# Altium project Extruder Fin.PrjPCB
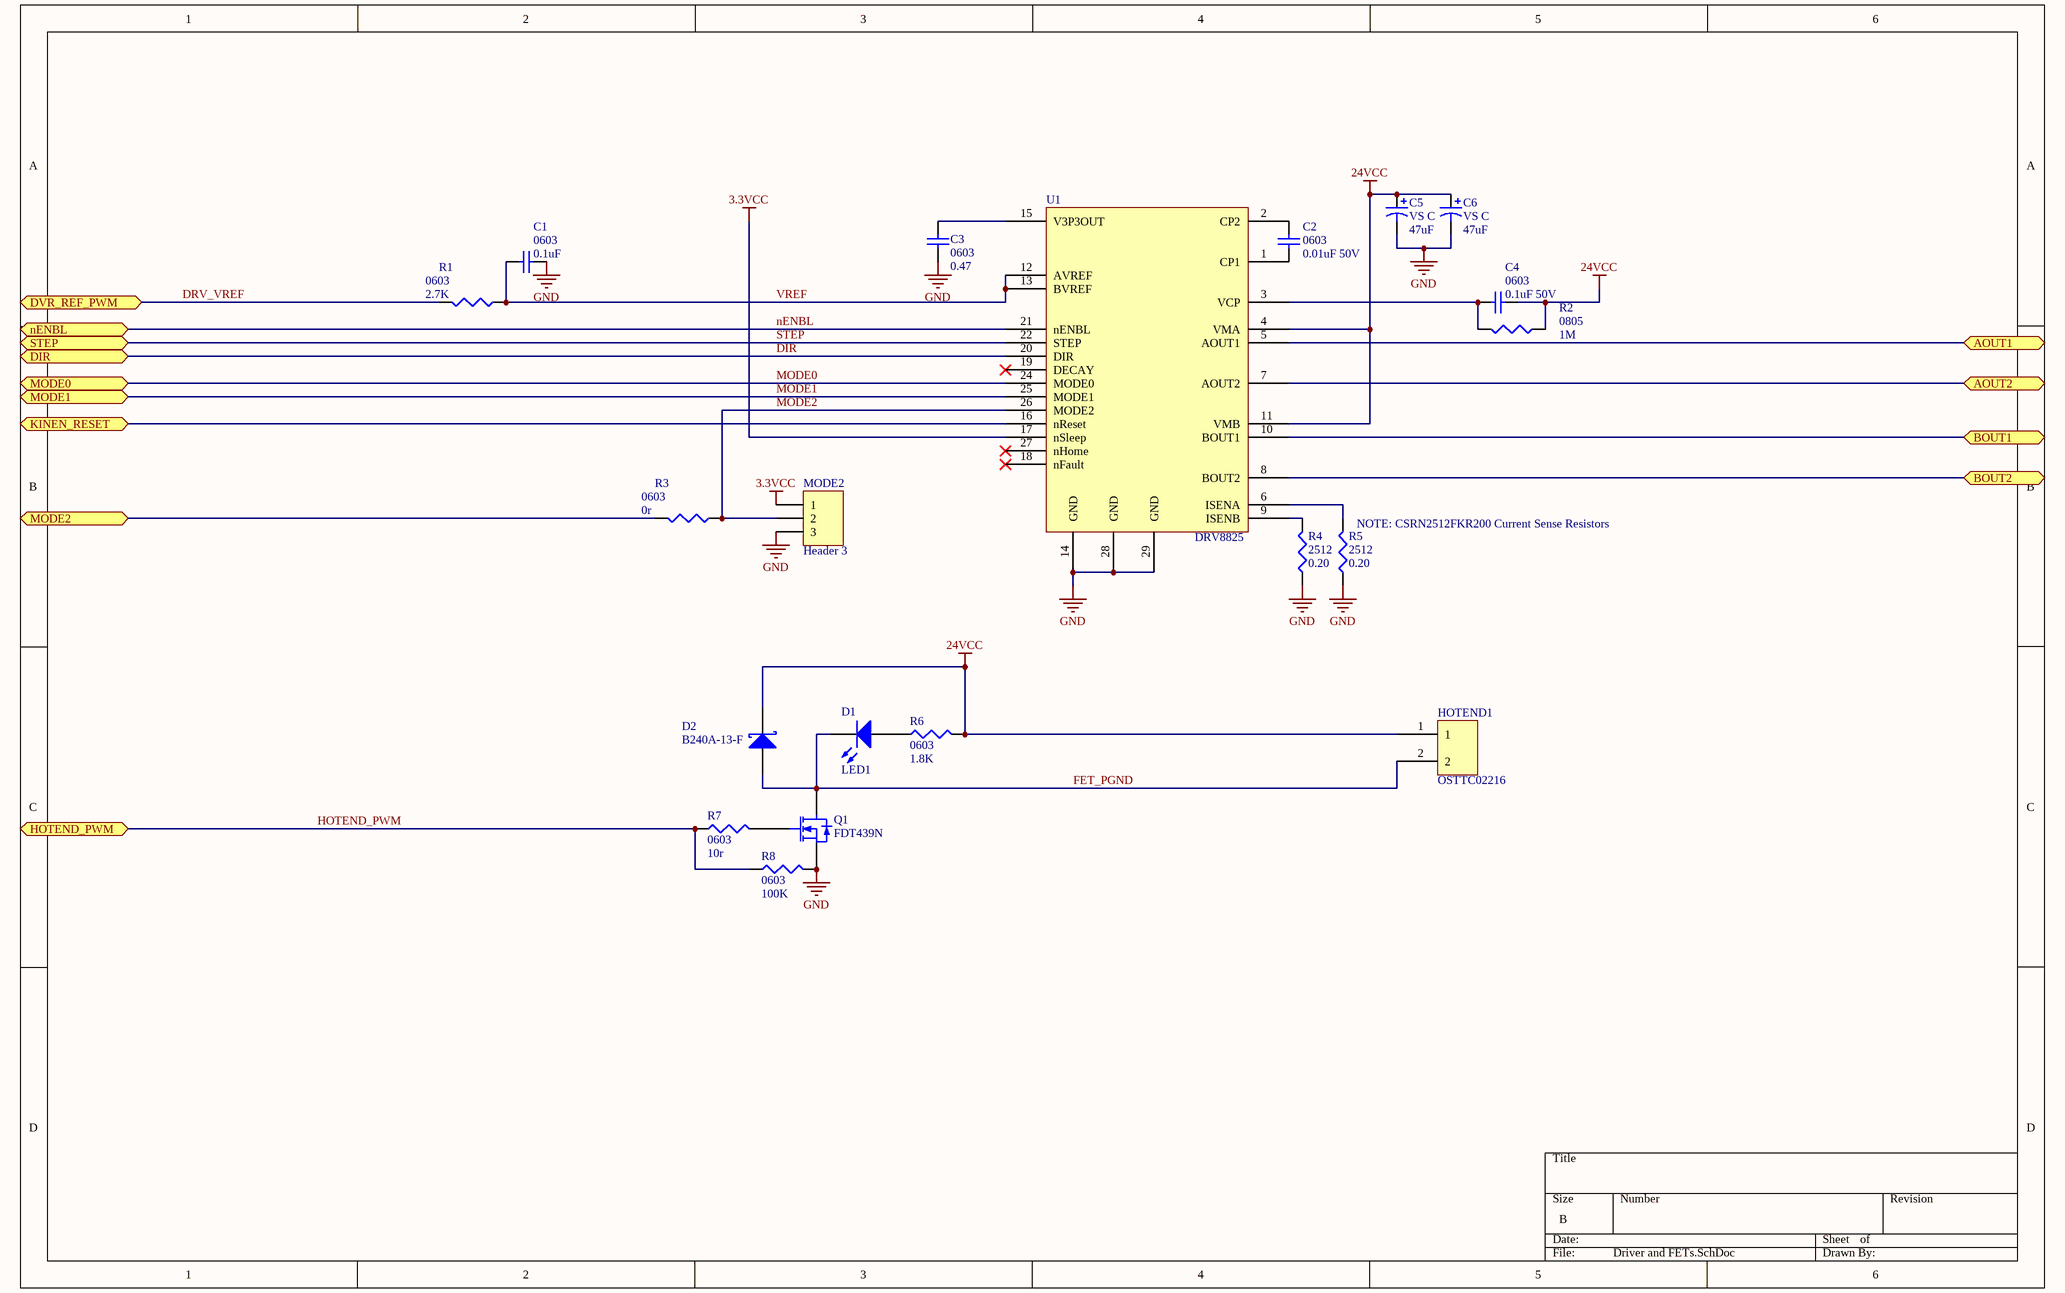
[diagram p0: Driver and FETs.SchDoc]
4 sheets, 68 parts. Net scope: flat (ports and power ports of the same name join across sheets).
Board file: Extruder Fin.PcbDoc
Sheets:
  Driver and FETs.SchDoc
  Kinen Port.SchDoc
  Fan FETs and Thermo.SchDoc
  CM0 Controller FreeScale.SchDoc

## Sheet Driver and FETs.SchDoc
size B

### Parts
C1  0603  value 0.1uF  [1608[0603]]
C2  0603  value 0.01uF 50V  [1608[0603]]
C3  0603  value 0.47  [1608[0603]]
C4  0603  value 0.1uF 50V  [1608[0603]]
C5  VS C  value 47uF  [Panasonic VS C]
C6  VS C  value 47uF  [Panasonic VS C]
D1  LED1  [SM 0805 polarized]
D2  B240A-13-F  [B240A-13-F]
HOTEND1  OSTTC02216  [OSTTC02216]
MODE2  Header 3  [HDR1X3]
Q1  FDT439N  [Fairchild FDT439N]
R1  0603  value 2.7K  [J1-0603]
R2  0805  value 1M  [SM 0805 - gap trimmed]
R3  0603  value 0r  [J1-0603]
R4  2512  value 0.20  [Resistor2512]
R5  2512  value 0.20  [Resistor2512]
R6  0603  value 1.8K  [J1-0603]
R7  0603  value 10r  [J1-0603]
R8  0603  value 100K  [J1-0603]
U1  DRV8825  [DRV8825]

### Ports
AOUT1, AOUT2, BOUT1, BOUT2, DIR, DVR_REF_PWM, HOTEND_PWM, KINEN_RESET, MODE0, MODE1, MODE2, nENBL, STEP

### Nets
2: Q1.4(D)
3.3VCC: MODE2.1 U1.17(nSleep)
24VCC: C4.1 C5.1 C6.1 D2.2(K) HOTEND1.1 R2.1 R6.2 U1.4(VMA) U1.11(VMB)
GND: C1.1 C3.1 C5.2 C6.2 MODE2.3 Q1.3(S) R4.1 R5.1 R8.2 U1.14(GND) U1.28(GND) U1.29(GND)
AOUT1: U1.5(AOUT1) ; port AOUT1
AOUT2: U1.7(AOUT2) ; port AOUT2
BOUT1: U1.10(BOUT1) ; port BOUT1
BOUT2: U1.8(BOUT2) ; port BOUT2
DIR: U1.20(DIR) ; port DIR
DRV_VREF: R1.2 ; port DVR_REF_PWM
FET_PGND: D1.2(K) D2.1(A) HOTEND1.2 Q1.2(D)
HOTEND_PWM: R7.1 R8.1 ; port HOTEND_PWM
KINEN_RESET: U1.16(nReset) ; port KINEN_RESET
MODE0: U1.24(MODE0) ; port MODE0
MODE1: U1.25(MODE1) ; port MODE1
MODE2: MODE2.2 R3.1 U1.26(MODE2)
nENBL: U1.21(nENBL) ; port nENBL
STEP: U1.22(STEP) ; port STEP
VREF: C1.2 R1.1 U1.12(AVREF) U1.13(BVREF)
NetC2_1: C2.1 U1.1(CP1)
NetC2_2: C2.2 U1.2(CP2)
NetC3_2: C3.2 U1.15(V3P3OUT)
NetC4_2: C4.2 R2.2 U1.3(VCP)
NetD1_1: D1.1(A) R6.1
NetKINEN_21: R3.2 ; port MODE2
NetQ1_1: Q1.1(G) R7.2
NetR4_2: R4.2 U1.9(ISENB)
NetR5_2: R5.2 U1.6(ISENA)

Not connected (* = marked no-connect by the designer): U1 18(nFault)* 19(DECAY)* 23(NC) 27(nHome)*

### Notes on the sheet
- (near R5) NOTE: CSRN2512FKR200 Current Sense Resistors

### Library data of the parts
C1-C4 = Cap Semi: Capacitor (Semiconductor SIM Model); Published: 8-Jun-2000; LatestRevisionDate: 29-May-2009; LatestRevisionNote: IPC-7351 Footprint Added.; PackageReference: C1206; Publisher: Altium Limited; PackageDescription: Chip Capacitor
C5 C6 = Cap Pol1: Polarized Capacitor (Radial); Published: 8-Jun-2000; LatestRevisionDate: 17-Jul-2002; LatestRevisionNote: Re-released for DXP Platform.; PackageReference: RB7.6-15; Publisher: Altium Limited; PackageDescription: Polarized Capacitor (Radial); 2 Leads
D1 = LED1: Typical RED GaAs LED; Published: 8-Jun-2000; LatestRevisionDate: 08-Jul-2005; LatestRevisionNote: Mech Layer 1 removed.; PackageReference: LED-1; Publisher: Altium Limited; PackageDescription: LED; 2 Leads
D2 = D Schottky: Schottky Diode; Published: 8-Jun-2000; LatestRevisionDate: 17-Jul-2002; LatestRevisionNote: Re-released for DXP Platform.; PackageReference: SMB; Publisher: Altium Limited; PackageDescription: DO-214-AA/SMB; 2 C-Bend Leads; Body 5.3 x 3.6 mm, inc. leads (LxW); Code_JEDEC: DO-214-AA
HOTEND1 = Pheonix Contact 2X1
MODE2 = Header 3: Header, 3-Pin; LatestRevisionDate: 17-Jul-2002; LatestRevisionNote: Re-released for DXP Platform.; Publisher: Altium Limited
Q1 = Fairchild FDT439N: N-Channel MOSFET; Published: 8-Jun-2000; LatestRevisionDate: 17-Jul-2002; LatestRevisionNote: Re-released for DXP Platform.; PackageVersion: 1995/1996; PackageReference: E3; Publisher: Altium Limited; PackageDescription: TO, Flat Index; 3 In-Line, Axial Leads; Body Dia. 4.6mm; Lead Dia. 0.5 mm (max)
R1-R8 = Res3: Resistor; Published: 8-Jun-2000; LatestRevisionDate: 29-May-2009; LatestRevisionNote: IPC-7351 Footprint Added.; PackageReference: J1-0603; Publisher: Altium Limited; PackageDescription: Chip Resistor
U1 = DRV8825: DRV8825 Ti Stepper Driver

## Sheet Kinen Port.SchDoc
size A
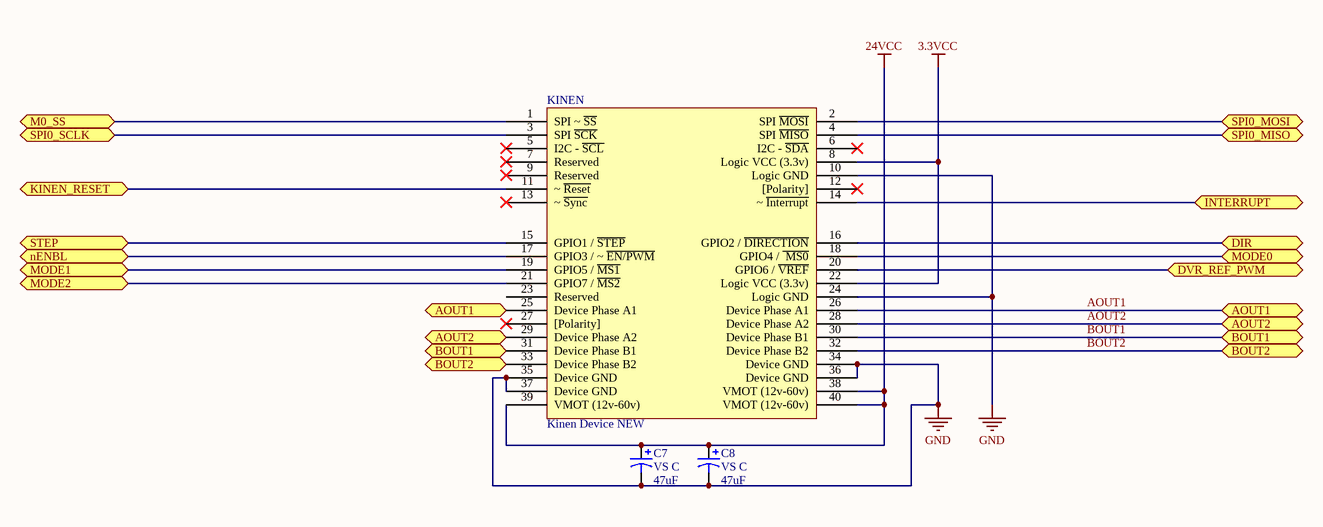
[diagram p1: Kinen Port.SchDoc]

### Parts
C7  VS C  value 47uF  [Panasonic VS C]
C8  VS C  value 47uF  [Panasonic VS C]
KINEN  Kinen Device NEW  [Kinen Port - Device]

### Ports
AOUT1, AOUT2, BOUT1, BOUT2, DIR, DVR_REF_PWM, INTERRUPT, KINEN_RESET, M0_SS, MODE0, MODE1, MODE2, nENBL, SPI0_MISO, SPI0_MOSI, SPI0_SCLK, STEP

### Nets
3.3VCC: KINEN.8(Logic_VCC_(3.3v)) KINEN.22(Logic_VCC_(3.3v))
24VCC: C7.1 C8.1 KINEN.38(VMOT_(12v-60v)) KINEN.39(VMOT_(12v-60v)) KINEN.40(VMOT_(12v-60v))
GND: C7.2 C8.2 KINEN.10(Logic_GND) KINEN.24(Logic_GND) KINEN.34(Device_GND) KINEN.35(Device_GND) KINEN.36(Device_GND) KINEN.37(Device_GND)
AOUT1: KINEN.25(Device_Phase_A1) KINEN.26(Device_Phase_A1) ; port AOUT1
AOUT2: KINEN.28(Device_Phase_A2) KINEN.29(Device_Phase_A2) ; port AOUT2
BOUT1: KINEN.30(Device_Phase_B1) KINEN.31(Device_Phase_B1) ; port BOUT1
BOUT2: KINEN.32(Device_Phase_B2) KINEN.33(Device_Phase_B2) ; port BOUT2
DIR: KINEN.16(GPIO2_/_~{DIRECTION}) ; port DIR
DRV_VREF: KINEN.20(GPIO6_/_~{VREF}) ; port DVR_REF_PWM
KINEN_RESET: KINEN.11(~_~{Reset}) ; port KINEN_RESET
M0_SS: KINEN.1(SPI_~_~{SS}) ; port M0_SS
MODE0: KINEN.18(GPIO4_/_~{_MS0}) ; port MODE0
MODE1: KINEN.19(GPIO5_/_~{MS1}) ; port MODE1
nENBL: KINEN.17(GPIO3_/_~_~{EN/PWM}) ; port nENBL
SPI0_MISO: KINEN.4(SPI_~{MISO}) ; port SPI0_MISO
SPI0_MOSI: KINEN.2(SPI_~{MOSI}) ; port SPI0_MOSI
SPI0_SCLK: KINEN.3(SPI_~{SCK}) ; port SPI0_SCLK
STEP: KINEN.15(GPIO1_/_~{STEP}) ; port STEP
NetKINEN_14: KINEN.14(~_~{Interrupt}) ; port INTERRUPT
NetKINEN_21: KINEN.21(GPIO7_/_~{MS2}) ; port MODE2

Not connected (* = marked no-connect by the designer): KINEN 5(I2C_-_~{SCL})* 6(I2C_-_~{SDA})* 7(Reserved)* 9(Reserved)* 12([Polarity])* 13(~_~{Sync})* 23(Reserved) 27([Polarity])*

### Library data of the parts
C7 C8 = Cap Pol1: Polarized Capacitor (Radial); Published: 8-Jun-2000; LatestRevisionDate: 17-Jul-2002; LatestRevisionNote: Re-released for DXP Platform.; PackageReference: RB7.6-15; Publisher: Altium Limited; PackageDescription: Polarized Capacitor (Radial); 2 Leads

## Sheet Fan FETs and Thermo.SchDoc
size A
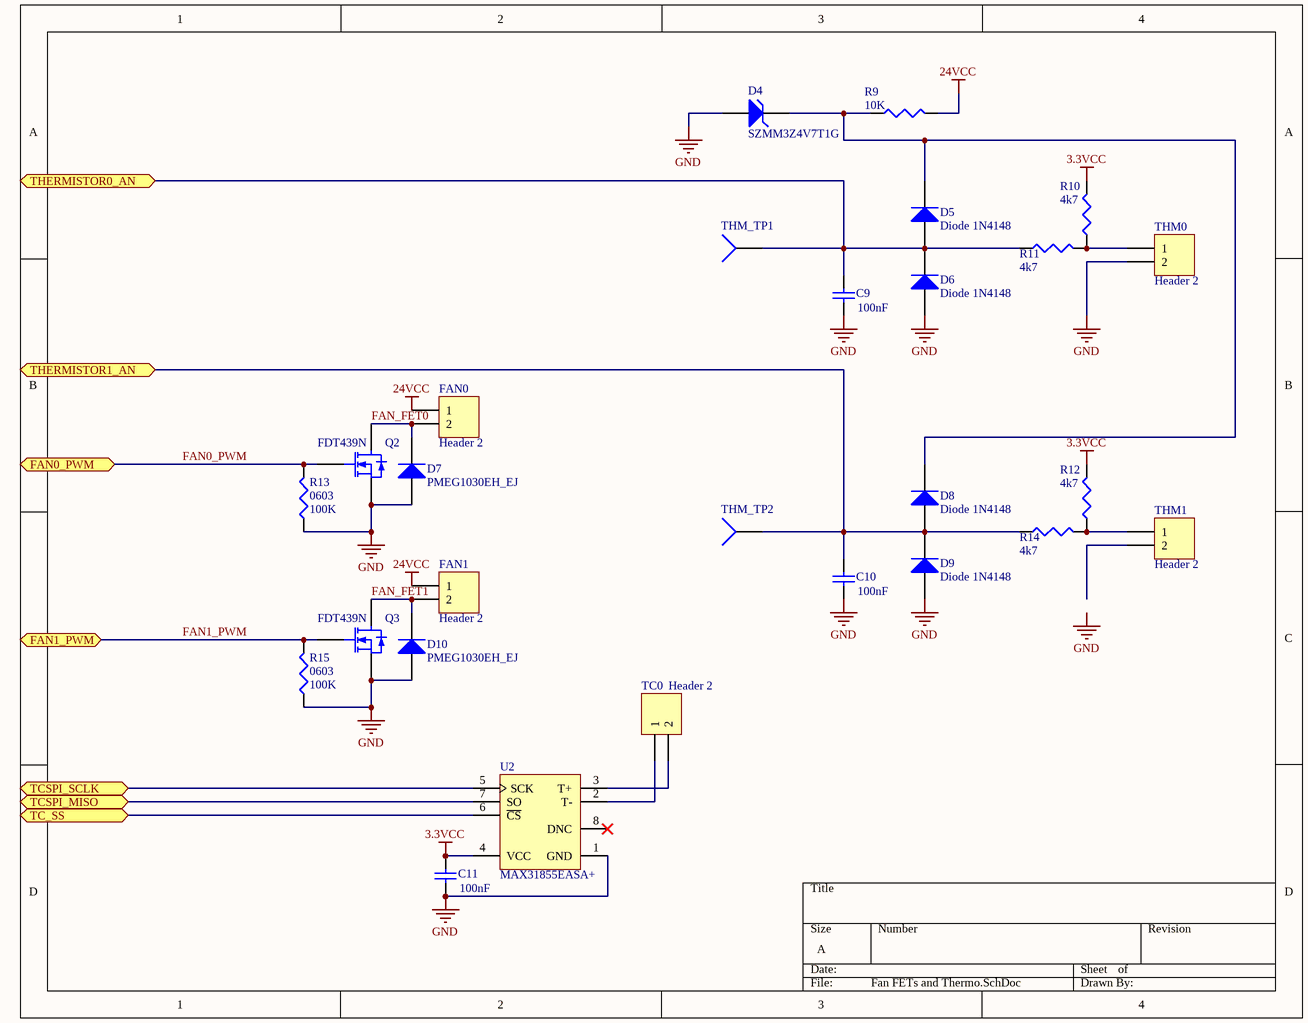
[diagram p2: Fan FETs and Thermo.SchDoc]

### Parts
C9  value 100nF  [1608[0603]]  (hidden comment: Cap Semi)
C10  value 100nF  [1608[0603]]  (hidden comment: Cap Semi)
C11  value 100nF  [1608[0603]]  (hidden comment: Cap Semi)
D4  SZMM3Z4V7T1G  [SZMM3Z4V7T1G]
D5  Diode 1N4148  [1N4148WT]
D6  Diode 1N4148  [1N4148WT]
D7  PMEG1030EH_EJ  [SOD-323]
D8  Diode 1N4148  [1N4148WT]
D9  Diode 1N4148  [1N4148WT]
D10  PMEG1030EH_EJ  [SOD-323]
FAN0  Header 2  [HDR1X2]
FAN1  Header 2  [HDR1X2]
Q2  FDT439N  [Fairchild FDT439N]
Q3  FDT439N  [Fairchild FDT439N]
R9  value 10K  [J1-0603]  (hidden comment: Res3)
R10  value 4k7  [J1-0603]  (hidden comment: Res3)
R11  value 4k7  [J1-0603]  (hidden comment: Res3)
R12  value 4k7  [J1-0603]  (hidden comment: Res3)
R13  0603  value 100K  [J1-0603]
R14  value 4k7  [J1-0603]  (hidden comment: Res3)
R15  0603  value 100K  [J1-0603]
TC0  Header 2  [HDR1X2]
THM0  Header 2  [HDR1X2]
THM1  Header 2  [HDR1X2]
THM_TP1  TP4  [PIN1]  (value not drawn)
THM_TP2  TP4  [PIN1]  (value not drawn)
U2  MAX31855EASA+  [MAXM-S8+4_N]

### Ports
FAN0_PWM, FAN1_PWM, TC_SS, TCSPI_MISO, TCSPI_SCLK, THERMISTOR0_AN, THERMISTOR1_AN

### Nets
2: Q2.4(D) Q3.4(D)
3.3VCC: C11.2 R10.2 R12.2 U2.4(VCC)
24VCC: FAN0.1 FAN1.1 R9.2
GND: C9.1 C10.1 C11.1 D4.1(A) D6.1(A) D7.1(A) D9.1(A) D10.1(A) Q2.3(S) Q3.3(S) R13.1 R15.1 THM0.2 U2.1(GND)
FAN0_PWM: Q2.1(G) R13.2 ; port FAN0_PWM
FAN1_PWM: Q3.1(G) R15.2 ; port FAN1_PWM
FAN_FET0: D7.2(K) FAN0.2 Q2.2(D)
FAN_FET1: D10.2(K) FAN1.2 Q3.2(D)
NetC9_2: C9.2 D5.1(A) D6.2(K) R11.1 THM_TP1.1 ; port THERMISTOR0_AN
NetC10_2: C10.2 D8.1(A) D9.2(K) R14.1 THM_TP2.1 ; port THERMISTOR1_AN
NetD4_2: D4.2(K) D5.2(K) D8.2(K) R9.1
NetR10_1: R10.1 R11.2 THM0.1
NetR12_1: R12.1 R14.2 THM1.1
NetTC0_1: TC0.1 U2.2(T-)
NetTC0_2: TC0.2 U2.3(T+)
NetU2_5: U2.5(SCK) ; port TCSPI_SCLK
NetU2_6: U2.6(~{CS}) ; port TC_SS
NetU2_7: U2.7(SO) ; port TCSPI_MISO

Not connected (* = marked no-connect by the designer): THM1 2; U2 8(DNC)*

### Notes on the sheet
- Labels drawn without touching a wire or pin: GND

### Library data of the parts
C9-C11 = Cap Semi: Capacitor (Semiconductor SIM Model); Published: 8-Jun-2000; LatestRevisionDate: 29-May-2009; LatestRevisionNote: IPC-7351 Footprint Added.; PackageReference: C1206; Publisher: Altium Limited; PackageDescription: Chip Capacitor
D4 = D Zener: Zener Diode; Published: 8-Jun-2000; LatestRevisionDate: 17-Jul-2002; LatestRevisionNote: Re-released for DXP Platform.; PackageReference: DIODE-0.7; Publisher: Altium Limited; PackageDescription: Diode, Thru-Hole; 2 Leads; 0.7 in Pin Spacing
D5 D6 D8 D9 = Diode 1N4148: High Conductance Fast Diode; Published: 8-Jun-2000; LatestRevisionDate: 17-Jul-2002; LatestRevisionNote: Re-released for DXP Platform.; DatasheetVersion: 1997; PackageReference: DO-35; Publisher: Altium Limited; PackageDescription: Diode, Axial; Body 3.8 x 1.9 mm (LxDia. max), Lead Dia. 0.53 mm (max); Code_JEDEC: DO-204-AH; ComponentLink1Description: Manufacturer Link; ComponentLink1URL: http://www.fairchildsemi.com/; ComponentLink2Description: Datasheet; ComponentLink2URL: http://www.fairchildsemi.com/ds/1N%2F1N4148.pdf
D7 D10 = Diode: Default Diode; Published: 8-Jun-2000; LatestRevisionDate: 17-Jul-2002; LatestRevisionNote: Re-released for DXP Platform.; PackageVersion: Sep-1996; PackageReference: SMC; Publisher: Altium Limited; PackageDescription: DO-214-AB/SMC; 2 C-Bend Leads; Body 7.9 x 5.9 mm, inc. leads (LxW); Code_JEDEC: DO-214-AB
FAN0 FAN1 TC0 THM0 THM1 = Header 2: Header, 2-Pin; LatestRevisionDate: 17-Jul-2002; LatestRevisionNote: Re-released for DXP Platform.; Publisher: Altium Limited
Q2 Q3 = Fairchild FDT439N: N-Channel MOSFET; Published: 8-Jun-2000; LatestRevisionDate: 17-Jul-2002; LatestRevisionNote: Re-released for DXP Platform.; PackageVersion: 1995/1996; PackageReference: E3; Publisher: Altium Limited; PackageDescription: TO, Flat Index; 3 In-Line, Axial Leads; Body Dia. 4.6mm; Lead Dia. 0.5 mm (max)
R9-R15 = Res3: Resistor; Published: 8-Jun-2000; LatestRevisionDate: 29-May-2009; LatestRevisionNote: IPC-7351 Footprint Added.; PackageReference: J1-0603; Publisher: Altium Limited; PackageDescription: Chip Resistor
THM_TP1 THM_TP2 = Socket: LatestRevisionDate: 17-Jul-2002; LatestRevisionNote: Re-released for DXP Platform.; Publisher: Altium Limited
U2 = MAX31855EASA+: Cold Junction Compensated Thermocouple to Digital Converter, 14 Bits Temperature Resolution, -40 to 125 degC, 8-Pin SOIC (S8+4), Pb-Free; Functions: Thermocouple-to-Digital Converter; Interface: SPI; Parasite Pwr.: No; DatasheetVersion: Rev. 2; PackageVersion: Rev. D, 10/2012; PackageReference: S8+4; PackageDescription: 8-Pin Small-Outline IC, Narrow, Body 3.9 x 4.9 mm, Pitch 1.27 mm; Supplier 1: Digi-Key; Supplier Part Number 1: MAX31855EASA+-ND; Supplier 2: Mouser; Supplier Part Number 2: 700-MAX31855EASA+; Generic Part Number: MAX31855; Mounting Technology: Surface Mount; Code_JEDEC: MS-012; PartNumber: MAX31855EASA+; ComponentLink1Description: Manufacturer URL; ComponentLink1URL: http://www.maximintegrated.com/; ComponentLink2Description: Datasheet; ComponentLink2URL: http://datasheets.maximintegrated.com/en/ds/MAX31855.pdf; ComponentLink3Description: Package Specification; ComponentLink3URL: http://pdfserv.maximintegrated.com/package_dwgs/21-0041.PDF

## Sheet CM0 Controller FreeScale.SchDoc
size A
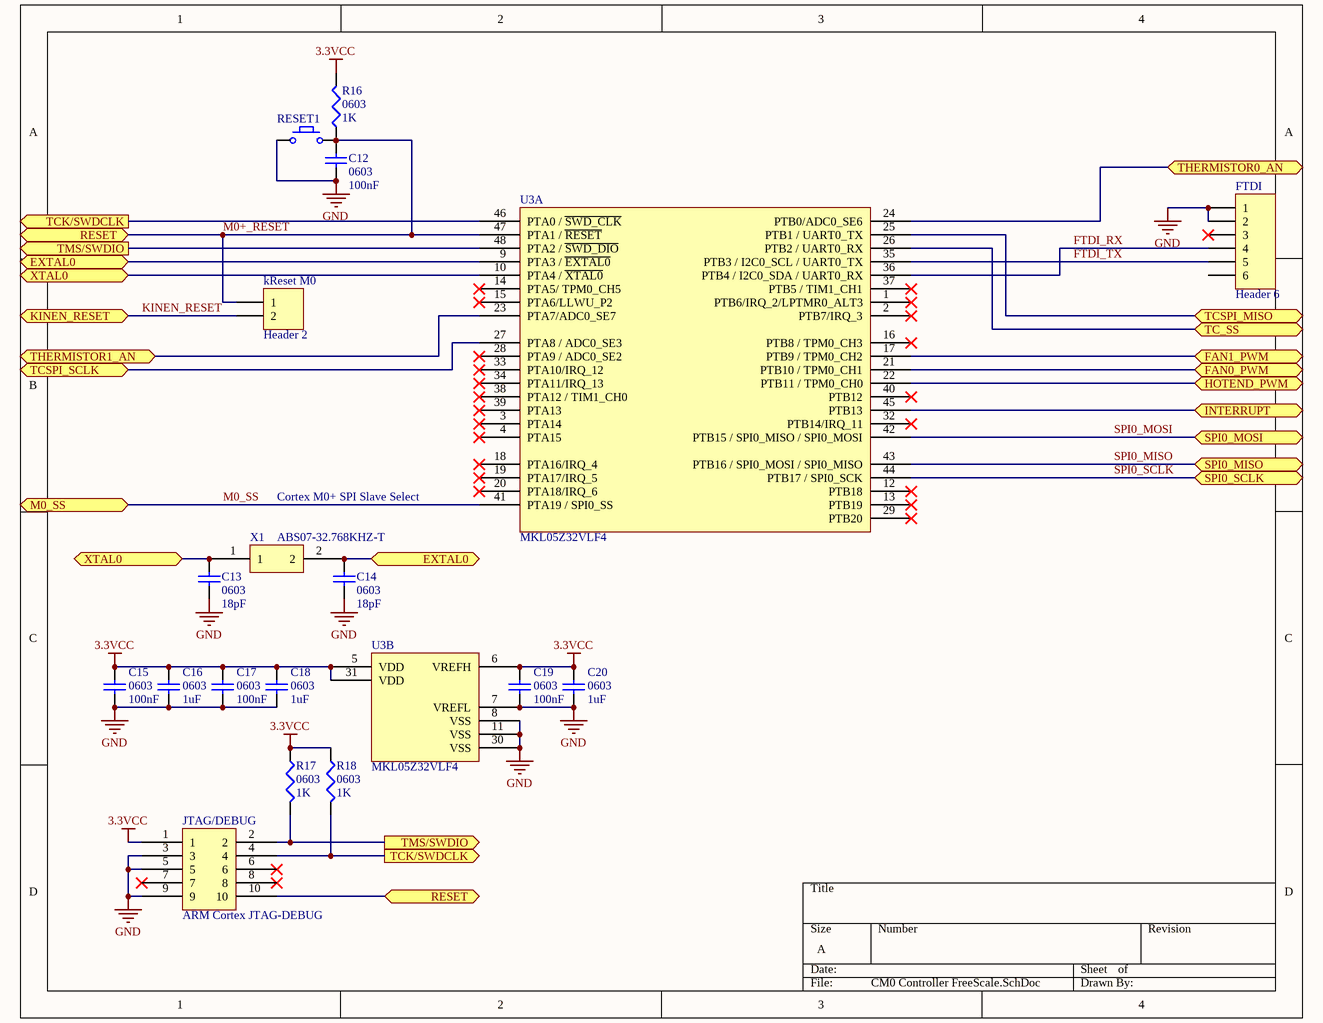
[diagram p3: CM0 Controller FreeScale.SchDoc]

### Parts
C12  0603  value 100nF  [1608[0603]]
C13  0603  value 18pF  [1608[0603]]
C14  0603  value 18pF  [1608[0603]]
C15  0603  value 100nF  [1608[0603]]
C16  0603  value 1uF  [1608[0603]]
C17  0603  value 100nF  [1608[0603]]
C18  0603  value 1uF  [1608[0603]]
C19  0603  value 100nF  [1608[0603]]
C20  0603  value 1uF  [1608[0603]]
FTDI  Header 6  [HDR1X6]
JTAG/DEBUG  ARM Cortex JTAG-DEBUG  [FTSH-105-XX-X-DV]
kReset_M0  Header 2  [HDR1X2]
R16  0603  value 1K  [J1-0603]
R17  0603  value 1K  [J1-0603]
R18  0603  value 1K  [J1-0603]
RESET1  Tactile Switch  [Mountain Switch TS6324T1607]  (value not drawn)
U3  MKL05Z32VLF4  [MKL05Z32VLF4]  (parts A,B of 2)
X1  ABS07-32.768KHZ-T  [ABS07-32.768KHZ-T]

### Ports
EXTAL0, FAN0_PWM, FAN1_PWM, HOTEND_PWM, INTERRUPT, KINEN_RESET, M0_SS, RESET (bidir), SPI0_MISO, SPI0_MOSI, SPI0_SCLK, TC_SS, TCK/SWDCLK (out), TCSPI_MISO, TCSPI_SCLK, THERMISTOR0_AN, THERMISTOR1_AN, TMS/SWDIO (out), XTAL0

### Nets
3.3VCC: C15.2 C16.2 C17.2 C18.2 C19.1 C20.1 JTAG/DEBUG.1 R16.2 R17.1 R18.1 U3.5(VDD) U3.6(VREFH) U3.31(VDD)
GND: C12.2 C13.2 C14.2 C15.1 C16.1 C17.1 C18.1 C19.2 C20.2 FTDI.1 FTDI.2 JTAG/DEBUG.3 JTAG/DEBUG.5 JTAG/DEBUG.9 RESET1.1 U3.7(VREFL) U3.8(VSS) U3.11(VSS) U3.30(VSS)
FAN0_PWM: U3.21(PTB10_/_TPM0_CH1) ; port FAN0_PWM
FAN1_PWM: U3.17(PTB9_/_TPM0_CH2) ; port FAN1_PWM
FTDI_RX: FTDI.4 U3.36(PTB4_/_I2C0_SDA_/_UART0_RX)
FTDI_TX: FTDI.5 U3.35(PTB3_/_I2C0_SCL_/_UART0_TX)
HOTEND_PWM: U3.22(PTB11_/_TPM0_CH0) ; port HOTEND_PWM
KINEN_RESET: kReset_M0.2 ; port KINEN_RESET
M0+_RESET: C12.1 JTAG/DEBUG.10 kReset_M0.1 R16.1 RESET1.2 U3.47(PTA1_/_~{RESET}) ; port RESET
M0_SS: U3.41(PTA19_/_SPI0_SS) ; port M0_SS
SPI0_MISO: U3.43(PTB16_/_SPI0_MOSI_/_SPI0_MISO) ; port SPI0_MISO
SPI0_MOSI: U3.42(PTB15_/_SPI0_MISO_/_SPI0_MOSI) ; port SPI0_MOSI
SPI0_SCLK: U3.44(PTB17_/_SPI0_SCK) ; port SPI0_SCLK
NetC9_2: U3.24(PTB0/ADC0_SE6) ; port THERMISTOR0_AN
NetC10_2: U3.23(PTA7/ADC0_SE7) ; port THERMISTOR1_AN
NetC13_1: C13.1 U3.10(PTA4_/_~{XTAL0}) X1.1 ; port XTAL0
NetC14_1: C14.1 U3.9(PTA3_/_~{EXTAL0}) X1.2 ; port EXTAL0
NetJTAG/DEBUG_2: JTAG/DEBUG.2 R17.2 U3.48(PTA2_/_~{SWD_DIO}) ; port TMS/SWDIO
NetJTAG/DEBUG_4: JTAG/DEBUG.4 R18.2 U3.46(PTA0_/_~{SWD_CLK}) ; port TCK/SWDCLK
NetKINEN_14: U3.45(PTB13) ; port INTERRUPT
NetU2_5: U3.27(PTA8_/_ADC0_SE3) ; port TCSPI_SCLK
NetU2_6: U3.26(PTB2_/_UART0_RX) ; port TC_SS
NetU2_7: U3.25(PTB1_/_UART0_TX) ; port TCSPI_MISO

Not connected (* = marked no-connect by the designer): FTDI 3* 6; JTAG/DEBUG 6* 7* 8*; U3 1(PTB6/IRQ_2/LPTMR0_ALT3)* 2(PTB7/IRQ_3)* 3(PTA14)* 4(PTA15)* 12(PTB18)* 13(PTB19)* 14(PTA5/_TPM0_CH5)* 15(PTA6/LLWU_P2)* 16(PTB8_/_TPM0_CH3)* 18(PTA16/IRQ_4)* 19(PTA17/IRQ_5)* 20(PTA18/IRQ_6)* 28(PTA9_/_ADC0_SE2)* 29(PTB20)* 32(PTB14/IRQ_11)* 33(PTA10/IRQ_12)* 34(PTA11/IRQ_13)* 37(PTB5_/_TIM1_CH1)* 38(PTA12_/_TIM1_CH0)* 39(PTA13)* 40(PTB12)*

### Notes on the sheet
- Cortex M0+ SPI Slave Select

### Library data of the parts
C12-C20 = Cap Semi: Capacitor (Semiconductor SIM Model); Published: 8-Jun-2000; LatestRevisionDate: 29-May-2009; LatestRevisionNote: IPC-7351 Footprint Added.; PackageReference: C1206; Publisher: Altium Limited; PackageDescription: Chip Capacitor
FTDI = Header 6: Header, 6-Pin; LatestRevisionDate: 17-Jul-2002; LatestRevisionNote: Re-released for DXP Platform.; Publisher: Altium Limited
JTAG/DEBUG = ARM Cortex JTAG-DEBUG Header
kReset_M0 = Header 2: Header, 2-Pin; LatestRevisionDate: 17-Jul-2002; LatestRevisionNote: Re-released for DXP Platform.; Publisher: Altium Limited
R16-R18 = Res3: Resistor; Published: 8-Jun-2000; LatestRevisionDate: 29-May-2009; LatestRevisionNote: IPC-7351 Footprint Added.; PackageReference: J1-0603; Publisher: Altium Limited; PackageDescription: Chip Resistor
U3 = MKL05Z32VLF4: ARM Cortex M0+
X1 = ABS07-32.768KHZ-T: ABS07-32.768KHZ-T RTC Crystal Oscillator

## Nets that join several sheets
2: Driver and FETs (Q1.4), Fan FETs and Thermo (Q2.4 Q3.4)
3.3VCC: Driver and FETs (MODE2.1 U1.17), Kinen Port (KINEN.8 KINEN.22), Fan FETs and Thermo (C11.2 R10.2 R12.2 U2.4), CM0 Controller FreeScale (13 pins)
24VCC: Driver and FETs (9 pins), Kinen Port (5 pins), Fan FETs and Thermo (FAN0.1 FAN1.1 R9.2)
GND: Driver and FETs (12 pins), Kinen Port (8 pins), Fan FETs and Thermo (14 pins), CM0 Controller FreeScale (19 pins)
AOUT1: Driver and FETs (U1.5), Kinen Port (KINEN.25 KINEN.26)
AOUT2: Driver and FETs (U1.7), Kinen Port (KINEN.28 KINEN.29)
BOUT1: Driver and FETs (U1.10), Kinen Port (KINEN.30 KINEN.31)
BOUT2: Driver and FETs (U1.8), Kinen Port (KINEN.32 KINEN.33)
DIR: Driver and FETs (U1.20), Kinen Port (KINEN.16)
DRV_VREF: Driver and FETs (R1.2), Kinen Port (KINEN.20)
FAN0_PWM: Fan FETs and Thermo (Q2.1 R13.2), CM0 Controller FreeScale (U3.21)
FAN1_PWM: Fan FETs and Thermo (Q3.1 R15.2), CM0 Controller FreeScale (U3.17)
HOTEND_PWM: Driver and FETs (R7.1 R8.1), CM0 Controller FreeScale (U3.22)
KINEN_RESET: Driver and FETs (U1.16), Kinen Port (KINEN.11), CM0 Controller FreeScale (kReset_M0.2)
M0_SS: Kinen Port (KINEN.1), CM0 Controller FreeScale (U3.41)
MODE0: Driver and FETs (U1.24), Kinen Port (KINEN.18)
MODE1: Driver and FETs (U1.25), Kinen Port (KINEN.19)
nENBL: Driver and FETs (U1.21), Kinen Port (KINEN.17)
NetC9_2: Fan FETs and Thermo (5 pins), CM0 Controller FreeScale (U3.24)
NetC10_2: Fan FETs and Thermo (5 pins), CM0 Controller FreeScale (U3.23)
NetKINEN_14: Kinen Port (KINEN.14), CM0 Controller FreeScale (U3.45)
NetKINEN_21: Driver and FETs (R3.2), Kinen Port (KINEN.21)
NetU2_5: Fan FETs and Thermo (U2.5), CM0 Controller FreeScale (U3.27)
NetU2_6: Fan FETs and Thermo (U2.6), CM0 Controller FreeScale (U3.26)
NetU2_7: Fan FETs and Thermo (U2.7), CM0 Controller FreeScale (U3.25)
SPI0_MISO: Kinen Port (KINEN.4), CM0 Controller FreeScale (U3.43)
SPI0_MOSI: Kinen Port (KINEN.2), CM0 Controller FreeScale (U3.42)
SPI0_SCLK: Kinen Port (KINEN.3), CM0 Controller FreeScale (U3.44)
STEP: Driver and FETs (U1.22), Kinen Port (KINEN.15)